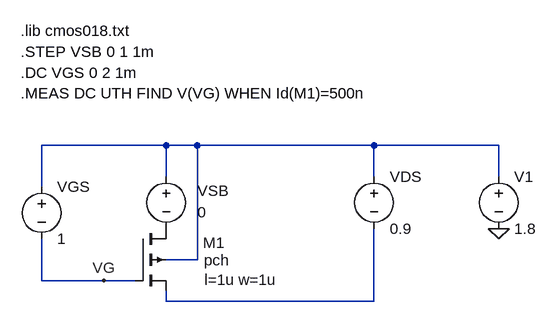
[diagram p0: schematic Draft3P.asc]
Draft3P.asc, the LTspice schematic file:
Version 4
SHEET 1 928 680
WIRE 256 64 64 64
WIRE 304 64 256 64
WIRE 576 64 304 64
WIRE 768 64 576 64
WIRE 256 112 256 64
WIRE 576 112 576 64
WIRE 768 112 768 64
WIRE 64 128 64 64
WIRE 304 240 304 64
WIRE 304 240 256 240
WIRE 64 272 64 208
WIRE 160 272 64 272
WIRE 208 272 160 272
WIRE 256 304 256 288
WIRE 576 304 576 192
WIRE 576 304 256 304
FLAG 160 272 VG
FLAG 768 192 0
SYMBOL voltage 576 96 R0
WINDOW 123 0 0 Left 0
WINDOW 39 0 0 Left 0
SYMATTR InstName VDS
SYMATTR Value 0.9
SYMBOL voltage 64 112 R0
WINDOW 123 0 0 Left 0
WINDOW 39 0 0 Left 0
SYMATTR InstName VGS
SYMATTR Value 1
SYMBOL pmos4 208 192 R0
WINDOW 0 105 22 Left 2
WINDOW 3 106 49 Left 2
WINDOW 123 107 79 Left 2
SYMATTR InstName M1
SYMATTR Value pch
SYMATTR Value2 l=1u w=1u
SYMBOL voltage 256 96 R0
WINDOW 0 48 38 Left 2
WINDOW 3 48 71 Left 2
WINDOW 123 0 0 Left 0
WINDOW 39 0 0 Left 0
SYMATTR InstName VSB
SYMATTR Value 0
SYMBOL voltage 768 96 R0
WINDOW 123 0 0 Left 0
WINDOW 39 0 0 Left 0
SYMATTR InstName V1
SYMATTR Value 1.8
TEXT 32 -112 Left 2 !.lib cmos018.txt
TEXT 32 -80 Left 2 !.STEP VSB 0 1 1m
TEXT 32 -16 Left 2 !.MEAS DC UTH FIND V(VG) WHEN Id(M1)=500n
TEXT 32 -48 Left 2 !.DC VGS 0 2 1m

The netlist it stands for:
* Draft3P.asc
VDS N001 N002 0.9
VGS N001 VG 1
M1 P001 VG N002 N001 pch l=1u w=1u
VSB N001 P001 0
V1 N001 0 1.8
.model NMOS NMOS
.model PMOS PMOS
.lib standard.mos
.lib cmos018.txt
.STEP VSB 0 1 1m
.MEAS DC UTH FIND V(VG) WHEN Id(M1)=500n
.DC VGS 0 2 1m
.backanno
.end